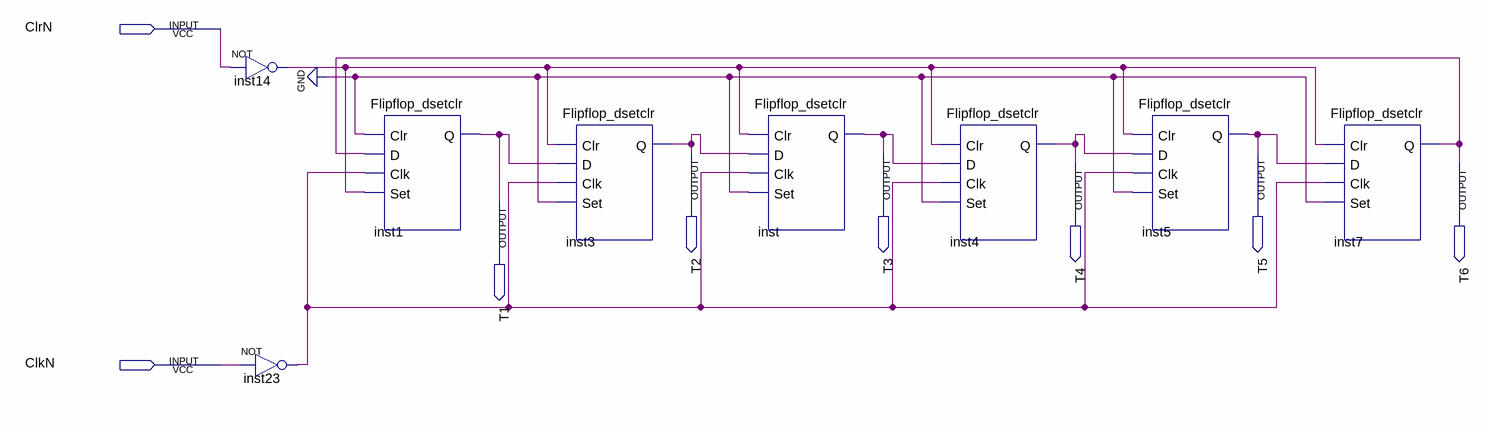
[diagram p0: schematic sheet]
// Quartus schematic countanel.bdf as structural Verilog: 8 symbols, 8 pins
module countanel (
  input  ClrN,
  input  ClkN,
  output T2,
  output T3,
  output T5,
  output T4,
  output T6,
  output T1
);

  wire inst14_out, inst23_out;

  not inst14 (inst14_out, ClrN);
  not inst23 (inst23_out, ClkN);
  Flipflop_dsetclr inst1 (.Clr(1'b0), .D(T6), .Clk(inst23_out), .Set(inst14_out), .Q(T1));
  Flipflop_dsetclr inst3 (.Clr(inst14_out), .D(T1), .Clk(inst23_out), .Set(1'b0), .Q(T2));
  Flipflop_dsetclr inst (.Clr(inst14_out), .D(T2), .Clk(inst23_out), .Set(1'b0), .Q(T3));
  Flipflop_dsetclr inst4 (.Clr(inst14_out), .D(T3), .Clk(inst23_out), .Set(1'b0), .Q(T4));
  Flipflop_dsetclr inst5 (.Clr(inst14_out), .D(T4), .Clk(inst23_out), .Set(1'b0), .Q(T5));
  Flipflop_dsetclr inst7 (.Clr(inst14_out), .D(T5), .Clk(inst23_out), .Set(1'b0), .Q(T6));
endmodule
